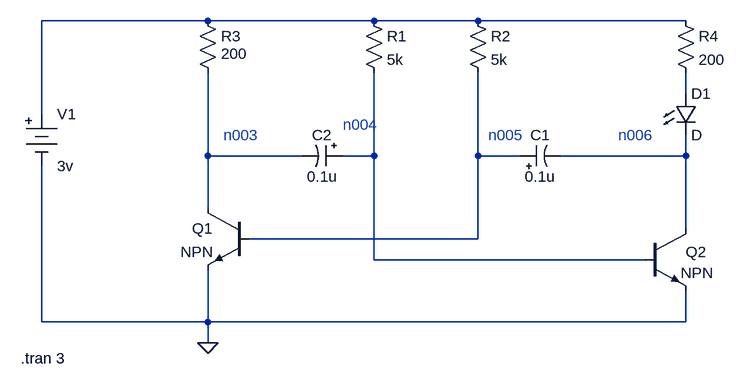
[diagram p0: schematic D-35_v-1.0_e-1_multi-vib.asc]
D-35_v-1.0_e-1_multi-vib.asc, the LTspice schematic file:
Version 4
SHEET 1 880 680
WIRE -48 -144 -304 -144
WIRE 208 -144 -48 -144
WIRE 368 -144 208 -144
WIRE 688 -144 368 -144
WIRE 688 -32 688 -64
WIRE -304 0 -304 -144
WIRE -48 64 -48 -64
WIRE 96 64 -48 64
WIRE 208 64 208 -64
WIRE 208 64 160 64
WIRE 368 64 368 -64
WIRE 432 64 368 64
WIRE 688 64 688 32
WIRE 688 64 496 64
WIRE -48 144 -48 64
WIRE 688 176 688 64
WIRE 368 192 368 64
WIRE 368 192 16 192
WIRE 208 224 208 64
WIRE 624 224 208 224
WIRE -304 320 -304 80
WIRE -48 320 -48 240
WIRE -48 320 -304 320
WIRE 688 320 688 272
WIRE 688 320 -48 320
WIRE -48 352 -48 320
FLAG -48 352 0
SYMBOL npn 16 144 M0
SYMATTR InstName Q1
SYMBOL npn 624 176 R0
WINDOW 0 64 36 Left 2
SYMATTR InstName Q2
SYMBOL polcap 432 80 R270
WINDOW 0 32 32 VTop 2
WINDOW 3 0 32 VBottom 2
SYMATTR InstName C1
SYMATTR Value 0.1u
SYMATTR Description Capacitor
SYMATTR Type cap
SYMATTR SpiceLine V=25 Irms=39m Rser=2.8 Lser=0 mfg="Nichicon" pn="UPR1E100MAH" type="Al electrolytic"
SYMBOL polcap 160 48 R90
WINDOW 0 0 32 VBottom 2
WINDOW 3 32 32 VTop 2
SYMATTR InstName C2
SYMATTR Value 0.1u
SYMATTR Description Capacitor
SYMATTR Type cap
SYMATTR SpiceLine V=25 Irms=24m Rser=5 Lser=0
SYMBOL res 192 -160 R0
SYMATTR InstName R1
SYMATTR Value 5k
SYMBOL res 352 -160 R0
SYMATTR InstName R2
SYMATTR Value 5k
SYMBOL res -64 -160 R0
WINDOW 3 36 67 Left 2
SYMATTR Value 200
SYMATTR InstName R3
SYMBOL res 672 -160 R0
SYMATTR InstName R4
SYMATTR Value 200
SYMBOL Misc\\battery -304 -16 R0
SYMATTR InstName V1
SYMATTR Value 3v
SYMBOL LED 672 -32 R0
SYMATTR InstName D1
TEXT -336 376 Left 2 !.tran 3
TEXT -24 32 Left 2 ;n003
TEXT 584 32 Left 2 ;n006
TEXT 160 16 Left 2 ;n004
TEXT 384 32 Left 2 ;n005

The netlist it stands for:
* D-35_v-1.0_e-1_multi-vib.asc
Q1 N003 N005 0 0 NPN
Q2 N006 N004 0 0 NPN
C1 N005 N006 0.1u V=25 Irms=39m Rser=2.8 Lser=0 mfg="Nichicon" pn="UPR1E100MAH" type="Al electrolytic"
C2 N004 N003 0.1u V=25 Irms=24m Rser=5 Lser=0
R1 N001 N004 5k
R2 N001 N005 5k
R3 N001 N003 200
R4 N001 N002 200
V1 N001 0 3v
D1 N002 N006 D
.model D D
.lib standard.dio
.model NPN NPN
.model PNP PNP
.lib standard.bjt
.tran 3
* n003
* n006
* n004
* n005
.backanno
.end